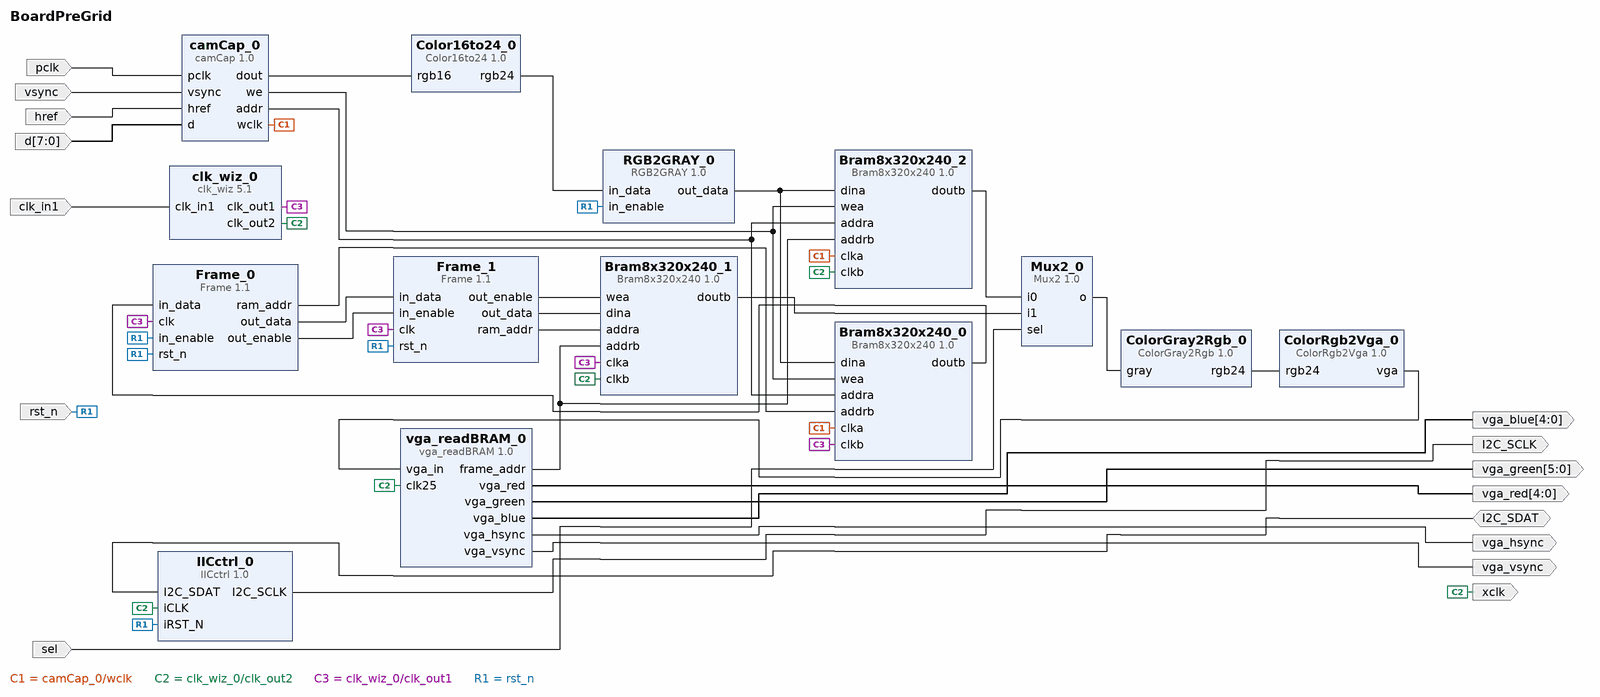
[diagram p0: block diagram of the top level]
# Vivado block design BoardPreGrid, Vivado 2014.4
create_bd_design BoardPreGrid

create_bd_port -dir O -type clk xclk
create_bd_port -dir I rst_n
create_bd_port -dir O -from 4 -to 0 vga_red
create_bd_port -dir O -from 5 -to 0 vga_green
create_bd_port -dir O -from 4 -to 0 vga_blue
create_bd_port -dir O vga_hsync
create_bd_port -dir O vga_vsync
create_bd_port -dir I -type clk clk_in1
create_bd_port -dir I pclk
create_bd_port -dir I vsync
create_bd_port -dir I href
create_bd_port -dir I -from 7 -to 0 d
create_bd_port -dir O I2C_SCLK
create_bd_port -dir IO I2C_SDAT
create_bd_port -dir I sel

create_bd_cell -type ip -vlnv xilinx.com:ip:clk_wiz:5.1 clk_wiz_0
set_property -dict [list \
  CONFIG.CLKOUT2_USED true \
  CONFIG.CLKOUT3_USED true \
  CONFIG.NUM_OUT_CLKS 3 \
  CONFIG.CLKOUT1_REQUESTED_OUT_FREQ 25 \
  CONFIG.CLKOUT2_REQUESTED_OUT_FREQ 25 \
  CONFIG.USE_LOCKED false \
  CONFIG.USE_RESET false \
  CONFIG.CLKOUT1_JITTER 175.402 \
  CONFIG.CLKOUT2_JITTER 175.402 \
  CONFIG.CLKOUT2_PHASE_ERROR 98.575 \
  CONFIG.CLKOUT3_JITTER 130.958 \
  CONFIG.CLKOUT3_PHASE_ERROR 98.575 \
] [get_bd_cells clk_wiz_0]
create_bd_cell -type ip -vlnv xilinx.com:ip:IICctrl:1.0 IICctrl_0
create_bd_cell -type ip -vlnv xilinx.com:XUP:camCap:1.0 camCap_0
create_bd_cell -type ip -vlnv xilinx.com:user:vga_readBRAM:1.0 vga_readBRAM_0
create_bd_cell -type ip -vlnv dtysky:Image:Color16to24:1.0 Color16to24_0
create_bd_cell -type ip -vlnv dtysky:Image:ColorGray2Rgb:1.0 ColorGray2Rgb_0
create_bd_cell -type ip -vlnv dtysky:Image:ColorRgb2Vga:1.0 ColorRgb2Vga_0
create_bd_cell -type ip -vlnv xilinx.com:ip:Bram8x320x240:1.0 Bram8x320x240_0
create_bd_cell -type ip -vlnv dtysky:Image:RGB2GRAY:1.0 RGB2GRAY_0
create_bd_cell -type ip -vlnv xilinx.com:ip:Bram8x320x240:1.0 Bram8x320x240_1
create_bd_cell -type ip -vlnv xilinx.com:ip:Bram8x320x240:1.0 Bram8x320x240_2
create_bd_cell -type ip -vlnv dtysky:user:Mux2:1.0 Mux2_0
create_bd_cell -type ip -vlnv dtysky:Image:Frame:1.1 Frame_0
set_property -dict {CONFIG.mode 1} [get_bd_cells Frame_0]
create_bd_cell -type ip -vlnv dtysky:Image:Frame:1.1 Frame_1

# ---- connections ----

connect_bd_net [get_bd_pins camCap_0/we] [get_bd_pins Bram8x320x240_0/wea] [get_bd_pins Bram8x320x240_2/wea]
connect_bd_net [get_bd_pins camCap_0/addr] [get_bd_pins Bram8x320x240_0/addra] [get_bd_pins Bram8x320x240_2/addra]
connect_bd_net [get_bd_pins camCap_0/wclk] [get_bd_pins Bram8x320x240_0/clka] [get_bd_pins Bram8x320x240_2/clka]
connect_bd_net [get_bd_pins camCap_0/dout] [get_bd_pins Color16to24_0/rgb16]
connect_bd_net [get_bd_pins Color16to24_0/rgb24] [get_bd_pins RGB2GRAY_0/in_data]
connect_bd_net [get_bd_pins RGB2GRAY_0/out_data] [get_bd_pins Bram8x320x240_0/dina] [get_bd_pins Bram8x320x240_2/dina]
connect_bd_net [get_bd_pins Bram8x320x240_0/doutb] [get_bd_pins Frame_0/in_data]
connect_bd_net [get_bd_pins Frame_0/ram_addr] [get_bd_pins Bram8x320x240_0/addrb]
connect_bd_net [get_bd_pins Frame_0/out_data] [get_bd_pins Frame_1/in_data]
connect_bd_net [get_bd_pins Frame_0/out_enable] [get_bd_pins Frame_1/in_enable]
connect_bd_net [get_bd_pins Frame_1/out_enable] [get_bd_pins Bram8x320x240_1/wea]
connect_bd_net [get_bd_pins Frame_1/out_data] [get_bd_pins Bram8x320x240_1/dina]
connect_bd_net [get_bd_pins Frame_1/ram_addr] [get_bd_pins Bram8x320x240_1/addra]
connect_bd_net [get_bd_pins clk_wiz_0/clk_out2] \
  [get_bd_ports xclk] [get_bd_pins IICctrl_0/iCLK] [get_bd_pins vga_readBRAM_0/clk25] [get_bd_pins Bram8x320x240_1/clkb] \
  [get_bd_pins Bram8x320x240_2/clkb]
connect_bd_net [get_bd_pins ColorGray2Rgb_0/rgb24] [get_bd_pins ColorRgb2Vga_0/rgb24]
connect_bd_net [get_bd_pins ColorRgb2Vga_0/vga] [get_bd_pins vga_readBRAM_0/vga_in]
connect_bd_net [get_bd_pins vga_readBRAM_0/frame_addr] [get_bd_pins Bram8x320x240_1/addrb] [get_bd_pins Bram8x320x240_2/addrb]
connect_bd_net [get_bd_pins clk_wiz_0/clk_out1] \
  [get_bd_pins Bram8x320x240_0/clkb] [get_bd_pins Bram8x320x240_1/clka] [get_bd_pins Frame_0/clk] [get_bd_pins Frame_1/clk]
connect_bd_net [get_bd_ports rst_n] \
  [get_bd_pins RGB2GRAY_0/in_enable] [get_bd_pins IICctrl_0/iRST_N] [get_bd_pins Frame_0/rst_n] \
  [get_bd_pins Frame_0/in_enable] [get_bd_pins Frame_1/rst_n]
connect_bd_net [get_bd_pins vga_readBRAM_0/vga_red] [get_bd_ports vga_red]
connect_bd_net [get_bd_pins vga_readBRAM_0/vga_green] [get_bd_ports vga_green]
connect_bd_net [get_bd_pins vga_readBRAM_0/vga_blue] [get_bd_ports vga_blue]
connect_bd_net [get_bd_pins vga_readBRAM_0/vga_hsync] [get_bd_ports vga_hsync]
connect_bd_net [get_bd_pins vga_readBRAM_0/vga_vsync] [get_bd_ports vga_vsync]
connect_bd_net -net clk_in1_1 [get_bd_ports clk_in1] [get_bd_pins clk_wiz_0/clk_in1]
connect_bd_net [get_bd_ports pclk] [get_bd_pins camCap_0/pclk]
connect_bd_net [get_bd_ports vsync] [get_bd_pins camCap_0/vsync]
connect_bd_net [get_bd_ports href] [get_bd_pins camCap_0/href]
connect_bd_net [get_bd_ports d] [get_bd_pins camCap_0/d]
connect_bd_net [get_bd_pins IICctrl_0/I2C_SCLK] [get_bd_ports I2C_SCLK]
connect_bd_net [get_bd_ports I2C_SDAT] [get_bd_pins IICctrl_0/I2C_SDAT]
connect_bd_net [get_bd_pins Bram8x320x240_1/doutb] [get_bd_pins Mux2_0/i1]
connect_bd_net [get_bd_pins Bram8x320x240_2/doutb] [get_bd_pins Mux2_0/i0]
connect_bd_net [get_bd_pins Mux2_0/o] [get_bd_pins ColorGray2Rgb_0/gray]
connect_bd_net [get_bd_ports sel] [get_bd_pins Mux2_0/sel]

validate_bd_design
save_bd_design
